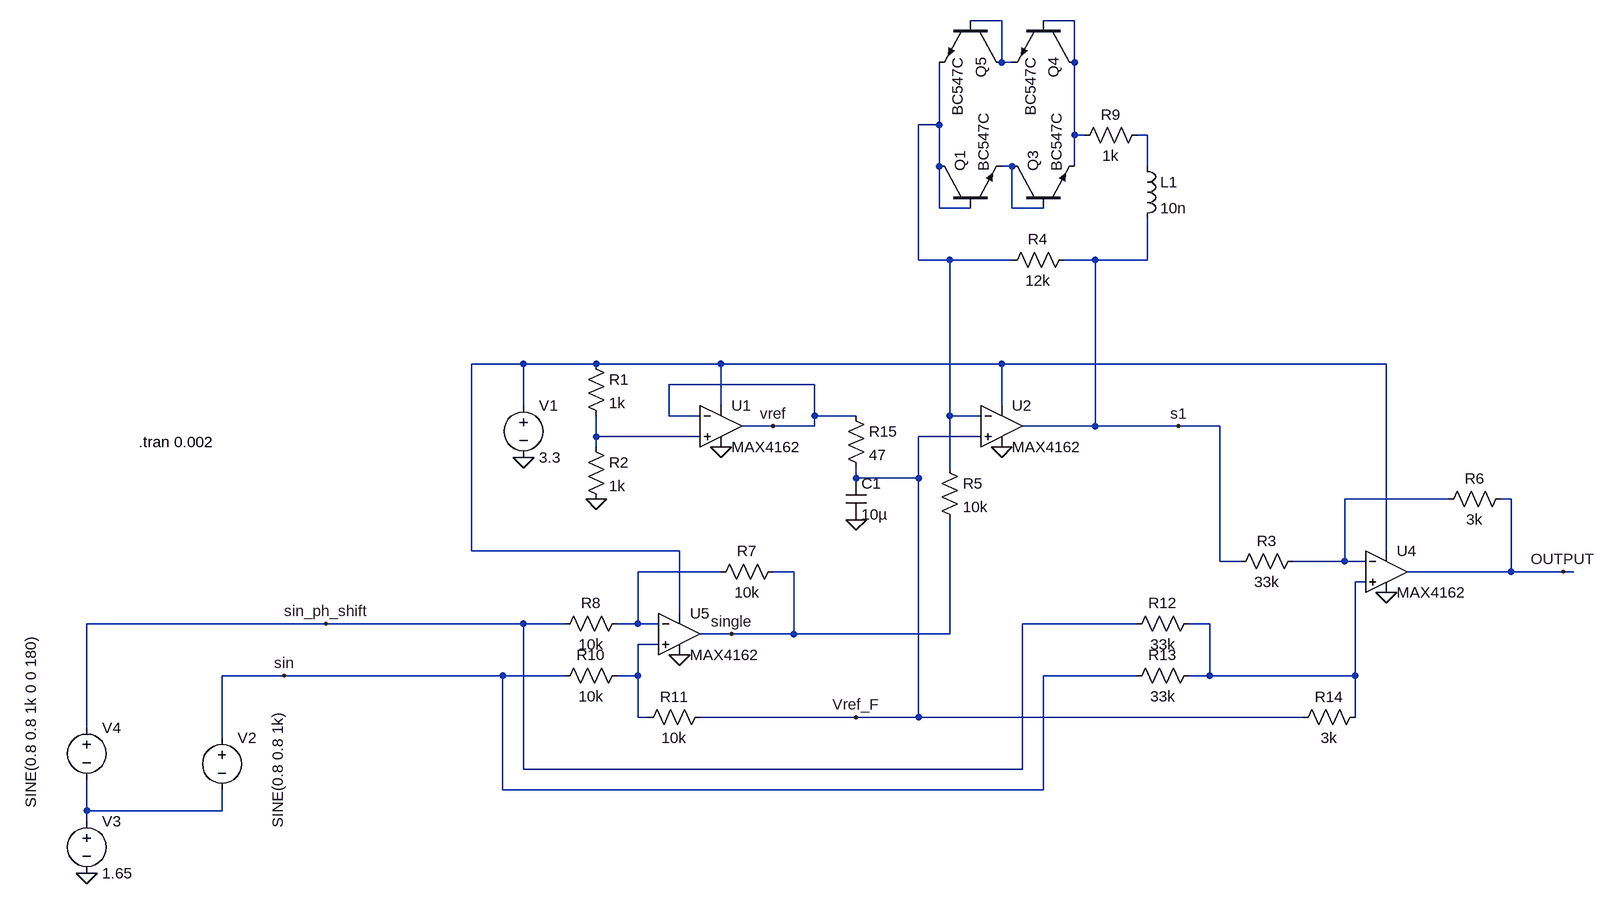
[diagram p0: schematic Sigmoid_test_2BJT_Diff_in_C.asc]
Sigmoid_test_2BJT_Diff_in_C.asc, the LTspice schematic file:
Version 4.1
SHEET 1 1540 868
WIRE 608 -464 560 -464
WIRE 720 -464 672 -464
WIRE 608 -400 608 -464
WIRE 624 -400 608 -400
WIRE 720 -400 720 -464
WIRE 512 -304 512 -400
WIRE 512 -304 480 -304
WIRE 720 -288 720 -400
WIRE 736 -288 720 -288
WIRE 832 -288 816 -288
WIRE 512 -240 512 -304
WIRE 624 -240 608 -240
WIRE 720 -240 720 -288
WIRE 832 -240 832 -288
WIRE 512 -176 512 -240
WIRE 560 -176 512 -176
WIRE 624 -176 624 -240
WIRE 672 -176 624 -176
WIRE 480 -96 480 -304
WIRE 528 -96 480 -96
WIRE 624 -96 528 -96
WIRE 752 -96 704 -96
WIRE 832 -96 832 -160
WIRE 832 -96 752 -96
WIRE -128 64 -208 64
WIRE -16 64 -128 64
WIRE 176 64 -16 64
WIRE 608 64 176 64
WIRE 1200 64 608 64
WIRE 320 96 96 96
WIRE -128 128 -128 64
WIRE 176 128 176 64
WIRE 608 128 608 64
WIRE 96 144 96 96
WIRE 144 144 96 144
WIRE 320 144 320 96
WIRE 384 144 320 144
WIRE 528 144 528 -96
WIRE 576 144 528 144
WIRE 256 160 208 160
WIRE 320 160 320 144
WIRE 320 160 256 160
WIRE 752 160 752 -96
WIRE 752 160 640 160
WIRE 880 160 752 160
WIRE 944 160 880 160
WIRE -16 176 -16 144
WIRE 144 176 -16 176
WIRE 576 176 480 176
WIRE -16 192 -16 176
WIRE 528 224 528 144
WIRE 384 240 384 224
WIRE 480 240 480 176
WIRE 480 240 384 240
WIRE 1296 272 1136 272
WIRE 1392 272 1376 272
WIRE -208 352 -208 64
WIRE 112 352 -208 352
WIRE 1200 352 1200 64
WIRE 944 368 944 160
WIRE 976 368 944 368
WIRE 1136 368 1136 272
WIRE 1136 368 1056 368
WIRE 1168 368 1136 368
WIRE 176 384 48 384
WIRE 288 384 256 384
WIRE 1392 384 1392 272
WIRE 1392 384 1232 384
WIRE 1472 384 1392 384
WIRE 1488 384 1472 384
WIRE 1168 400 1152 400
WIRE 112 448 112 352
WIRE -432 464 -800 464
WIRE -128 464 -432 464
WIRE -64 464 -128 464
WIRE 48 464 48 384
WIRE 48 464 16 464
WIRE 80 464 48 464
WIRE 816 464 640 464
WIRE 928 464 896 464
WIRE 192 480 144 480
WIRE 288 480 288 384
WIRE 288 480 192 480
WIRE 528 480 528 304
WIRE 528 480 288 480
WIRE 80 496 48 496
WIRE -496 544 -592 544
WIRE -160 544 -496 544
WIRE -64 544 -160 544
WIRE 48 544 48 496
WIRE 48 544 16 544
WIRE 816 544 672 544
WIRE 928 544 928 464
WIRE 928 544 896 544
WIRE 1152 544 1152 400
WIRE 1152 544 928 544
WIRE 48 608 48 544
WIRE 64 608 48 608
WIRE 384 608 144 608
WIRE 480 608 480 240
WIRE 480 608 384 608
WIRE 1072 608 480 608
WIRE 1152 608 1152 544
WIRE -800 624 -800 464
WIRE -592 640 -592 544
WIRE -128 688 -128 464
WIRE 640 688 640 464
WIRE 640 688 -128 688
WIRE -160 720 -160 544
WIRE 672 720 672 544
WIRE 672 720 -160 720
WIRE -800 752 -800 704
WIRE -592 752 -592 720
WIRE -592 752 -800 752
WIRE -800 768 -800 752
FLAG -128 208 0
FLAG 176 192 0
FLAG -16 272 0
FLAG 608 192 0
FLAG 256 160 vref
FLAG -496 544 sin
FLAG 1200 416 0
FLAG 880 160 s1
FLAG 112 512 0
FLAG 192 480 single
FLAG -800 848 0
FLAG -432 464 sin_ph_shift
FLAG 1472 384 OUTPUT
FLAG 384 304 0
FLAG 384 608 Vref_F
SYMBOL OpAmps\\MAX4162 176 96 R0
SYMATTR InstName U1
SYMBOL voltage -128 112 R0
WINDOW 123 0 0 Left 0
WINDOW 39 0 0 Left 0
SYMATTR InstName V1
SYMATTR Value 3.3
SYMBOL res -32 48 R0
SYMATTR InstName R1
SYMATTR Value 1k
SYMBOL res -32 176 R0
SYMATTR InstName R2
SYMATTR Value 1k
SYMBOL OpAmps\\MAX4162 608 96 R0
SYMATTR InstName U2
SYMBOL voltage -592 624 R0
WINDOW 123 0 0 Left 0
WINDOW 39 0 0 Left 0
WINDOW 3 86 -24 VRight 2
SYMATTR InstName V2
SYMATTR Value SINE(0.8 0.8 1k)
SYMBOL res 720 -112 R90
WINDOW 0 0 56 VBottom 2
WINDOW 3 32 56 VTop 2
SYMATTR InstName R4
SYMATTR Value 12k
SYMBOL res 512 208 R0
SYMATTR InstName R5
SYMATTR Value 10k
SYMBOL OpAmps\\MAX4162 1200 320 R0
SYMATTR InstName U4
SYMBOL res 832 -304 R90
WINDOW 0 0 56 VBottom 2
WINDOW 3 32 56 VTop 2
SYMATTR InstName R9
SYMATTR Value 1k
SYMBOL res 1072 352 R90
WINDOW 0 0 56 VBottom 2
WINDOW 3 32 56 VTop 2
SYMATTR InstName R3
SYMATTR Value 33k
SYMBOL res 1392 256 R90
WINDOW 0 0 56 VBottom 2
WINDOW 3 32 56 VTop 2
SYMATTR InstName R6
SYMATTR Value 3k
SYMBOL npn 512 -176 R270
SYMATTR InstName Q1
SYMATTR Value BC547C
SYMBOL npn 624 -176 R270
SYMATTR InstName Q3
SYMATTR Value BC547C
SYMBOL npn 720 -464 R90
SYMATTR InstName Q4
SYMATTR Value BC547C
SYMBOL npn 608 -464 R90
SYMATTR InstName Q5
SYMATTR Value BC547C
SYMBOL ind 816 -256 R0
SYMATTR InstName L1
SYMATTR Value 10n
SYMATTR SpiceLine Rser=1m
SYMBOL OpAmps\\MAX4162 112 416 R0
SYMATTR InstName U5
SYMBOL res 272 368 R90
WINDOW 0 0 56 VBottom 2
WINDOW 3 32 56 VTop 2
SYMATTR InstName R7
SYMATTR Value 10k
SYMBOL res 32 448 R90
WINDOW 0 0 56 VBottom 2
WINDOW 3 32 56 VTop 2
SYMATTR InstName R8
SYMATTR Value 10k
SYMBOL res 32 528 R90
WINDOW 0 0 56 VBottom 2
WINDOW 3 32 56 VTop 2
SYMATTR InstName R10
SYMATTR Value 10k
SYMBOL res 160 592 R90
WINDOW 0 0 56 VBottom 2
WINDOW 3 32 56 VTop 2
SYMATTR InstName R11
SYMATTR Value 10k
SYMBOL voltage -800 752 R0
WINDOW 123 0 0 Left 0
WINDOW 39 0 0 Left 0
SYMATTR InstName V3
SYMATTR Value 1.65
SYMBOL voltage -800 608 R0
WINDOW 123 0 0 Left 0
WINDOW 39 0 0 Left 0
WINDOW 3 -86 -127 VRight 2
SYMATTR InstName V4
SYMATTR Value SINE(0.8 0.8 1k 0 0 180)
SYMBOL res 912 448 R90
WINDOW 0 0 56 VBottom 2
WINDOW 3 32 56 VTop 2
SYMATTR InstName R12
SYMATTR Value 33k
SYMBOL res 912 528 R90
WINDOW 0 0 56 VBottom 2
WINDOW 3 32 56 VTop 2
SYMATTR InstName R13
SYMATTR Value 33k
SYMBOL res 1168 592 R90
WINDOW 0 0 56 VBottom 2
WINDOW 3 32 56 VTop 2
SYMATTR InstName R14
SYMATTR Value 3k
SYMBOL cap 368 240 R0
SYMATTR InstName C1
SYMATTR Value 10µ
SYMBOL res 368 128 R0
SYMATTR InstName R15
SYMATTR Value 47
TEXT -720 184 Left 2 !.tran 0.002

The netlist it stands for:
* Sigmoid_test_2BJT_Diff_in_C.asc
X§U1 N007 vref N006 0 vref MAX4162  ; pins In+ In- V+ V- OUT
V1 N006 0 3.3
R1 N006 N007 1k
R2 N007 0 1k
X§U2 Vref_F N003 N006 0 s1 MAX4162  ; pins In+ In- V+ V- OUT
V2 sin N012 SINE(0.8 0.8 1k)
R4 s1 N003 12k
R5 N003 single 10k
X§U4 N010 N008 N006 0 OUTPUT MAX4162  ; pins In+ In- V+ V- OUT
R9 N004 N002 1k
R3 N008 s1 33k
R6 OUTPUT N008 3k
Q1 N003 N003 N005 0 BC547C
Q3 N005 N005 N002 0 BC547C
Q4 N002 N002 N001 0 BC547C
Q5 N001 N001 N003 0 BC547C
L1 N004 s1 10n Rser=1m
X§U5 N011 N009 N006 0 single MAX4162  ; pins In+ In- V+ V- OUT
R7 single N009 10k
R8 N009 sin_ph_shift 10k
R10 N011 sin 10k
R11 Vref_F N011 10k
V3 N012 0 1.65
V4 sin_ph_shift N012 SINE(0.8 0.8 1k 0 0 180)
R12 N010 sin_ph_shift 33k
R13 N010 sin 33k
R14 N010 Vref_F 3k
C1 Vref_F 0 10µ
R15 vref Vref_F 47
.model NPN NPN
.model PNP PNP
.lib standard.bjt
.tran 0.002
.backanno
.end